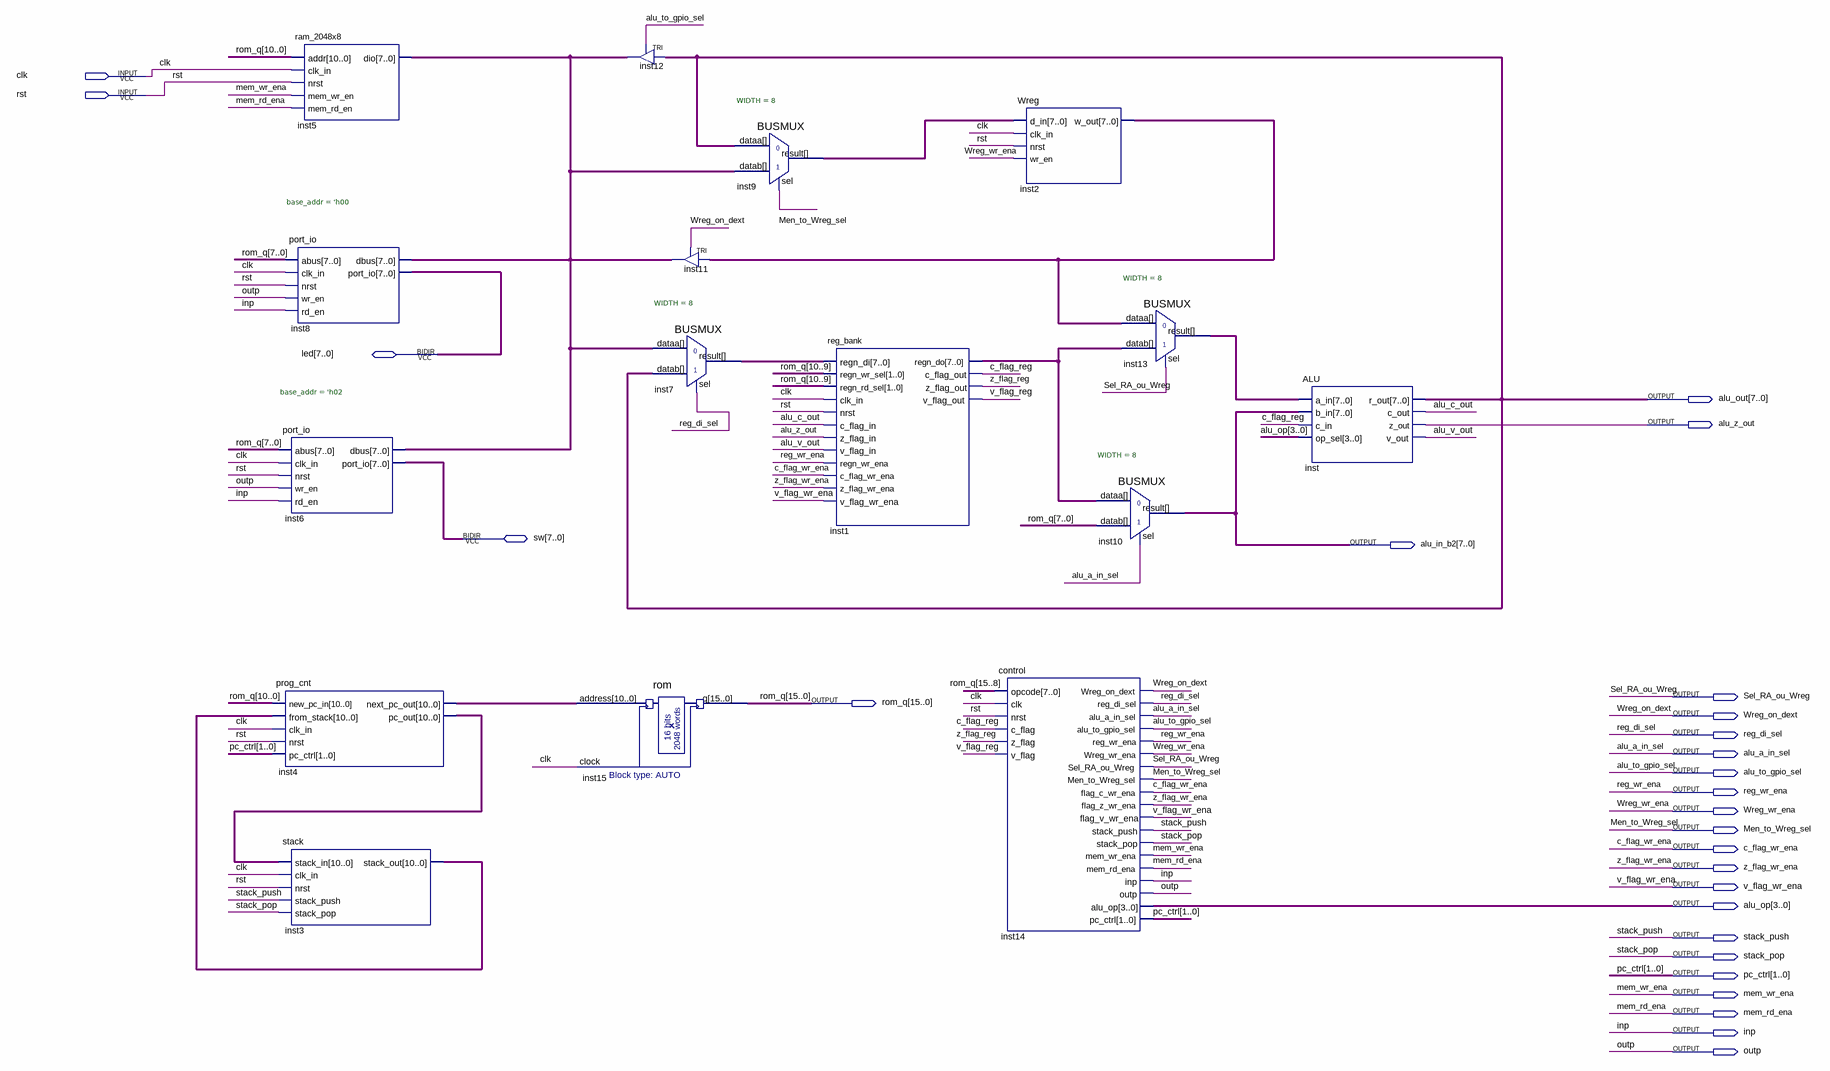
[diagram p0: schematic sheet]
// Quartus schematic puc251.bdf as structural Verilog: 16 symbols, 27 pins
module puc251 (
  input  clk,
  input  rst,
  inout  [7:0] led,
  inout  [7:0] sw,
  output [7:0] alu_out,
  output alu_z_out,
  output [7:0] alu_in_b2,
  output Sel_RA_ou_Wreg,
  output [15:0] rom_q,
  output Wreg_on_dext,
  output reg_di_sel,
  output alu_a_in_sel,
  output alu_to_gpio_sel,
  output reg_wr_ena,
  output Wreg_wr_ena,
  output Men_to_Wreg_sel,
  output c_flag_wr_ena,
  output z_flag_wr_ena,
  output v_flag_wr_ena,
  output [3:0] alu_op,
  output stack_push,
  output stack_pop,
  output [1:0] pc_ctrl,
  output mem_wr_ena,
  output mem_rd_ena,
  output inp,
  output outp
);

  wire alu_c_out, alu_v_out, c_flag_reg, v_flag_reg, z_flag_reg;
  wire [7:0] inst1_regn_do, inst2_w_out, inst5_dio, inst7_result, inst9_result, inst13_result;
  wire [10:0] inst3_stack_out, inst4_next_pc_out, inst4_pc_out;

  ram_2048x8 inst5 (
    .addr(rom_q[10:0]), .clk_in(clk), .nrst(rst), .mem_wr_en(mem_wr_ena), .mem_rd_en(mem_rd_ena),
    .dio(inst5_dio));
  port_io #(.base_addr('h00)) inst8 (
    .abus(rom_q[7:0]), .clk_in(clk), .nrst(rst), .wr_en(outp), .rd_en(inp), .dbus(inst5_dio), .port_io(led));
  port_io #(.base_addr('h02)) inst6 (
    .abus(rom_q[7:0]), .clk_in(clk), .nrst(rst), .wr_en(outp), .rd_en(inp), .dbus(inst5_dio), .port_io(sw));
  prog_cnt inst4 (
    .new_pc_in(rom_q[10:0]), .from_stack(inst3_stack_out), .clk_in(clk), .nrst(rst), .pc_ctrl(pc_ctrl),
    .next_pc_out(inst4_next_pc_out), .pc_out(inst4_pc_out));
  stack inst3 (
    .stack_in(inst4_pc_out), .clk_in(clk), .nrst(rst), .stack_push(stack_push), .stack_pop(stack_pop),
    .stack_out(inst3_stack_out));
  rom inst15 (.address(inst4_next_pc_out), .clock(clk), .q(rom_q));
  TRI inst12[7:0] (.IN(alu_out), .OE(alu_to_gpio_sel), .OUT(inst5_dio));
  BUSMUX #(.WIDTH(8)) inst7 (.datab(alu_out), .sel(reg_di_sel), .dataa(inst5_dio), .result(inst7_result));
  TRI inst11[7:0] (.IN(inst2_w_out), .OE(Wreg_on_dext), .OUT(inst5_dio));
  BUSMUX #(.WIDTH(8)) inst9 (.datab(inst5_dio), .sel(Men_to_Wreg_sel), .dataa(alu_out), .result(inst9_result));
  reg_bank inst1 (
    .regn_di(inst7_result), .regn_wr_sel(rom_q[10:9]), .regn_rd_sel(rom_q[10:9]), .clk_in(clk), .nrst(rst),
    .c_flag_in(alu_c_out), .z_flag_in(alu_z_out), .v_flag_in(alu_v_out), .regn_wr_ena(reg_wr_ena),
    .c_flag_wr_ena(c_flag_wr_ena), .z_flag_wr_ena(z_flag_wr_ena), .v_flag_wr_ena(v_flag_wr_ena),
    .regn_do(inst1_regn_do), .c_flag_out(c_flag_reg), .z_flag_out(z_flag_reg), .v_flag_out(v_flag_reg));
  control inst14 (
    .opcode(rom_q[15:8]), .clk(clk), .nrst(rst), .c_flag(c_flag_reg), .z_flag(z_flag_reg),
    .v_flag(v_flag_reg), .Wreg_on_dext(Wreg_on_dext), .reg_di_sel(reg_di_sel), .alu_a_in_sel(alu_a_in_sel),
    .alu_to_gpio_sel(alu_to_gpio_sel), .reg_wr_ena(reg_wr_ena), .Wreg_wr_ena(Wreg_wr_ena),
    .Sel_RA_ou_Wreg(Sel_RA_ou_Wreg), .Men_to_Wreg_sel(Men_to_Wreg_sel), .flag_c_wr_ena(c_flag_wr_ena),
    .flag_z_wr_ena(z_flag_wr_ena), .flag_v_wr_ena(v_flag_wr_ena), .stack_push(stack_push),
    .stack_pop(stack_pop), .mem_wr_ena(mem_wr_ena), .mem_rd_ena(mem_rd_ena), .inp(inp), .outp(outp),
    .alu_op(alu_op), .pc_ctrl(pc_ctrl));
  Wreg inst2 (.d_in(inst9_result), .clk_in(clk), .nrst(rst), .wr_en(Wreg_wr_ena), .w_out(inst2_w_out));
  BUSMUX #(.WIDTH(8)) inst10 (.datab(rom_q[7:0]), .sel(alu_a_in_sel), .dataa(inst1_regn_do), .result(alu_in_b2));
  BUSMUX #(.WIDTH(8)) inst13 (.datab(inst1_regn_do), .sel(Sel_RA_ou_Wreg), .dataa(inst2_w_out), .result(inst13_result));
  ALU inst (
    .a_in(inst13_result), .b_in(alu_in_b2), .c_in(c_flag_reg), .op_sel(alu_op), .r_out(alu_out),
    .c_out(alu_c_out), .z_out(alu_z_out), .v_out(alu_v_out));
endmodule
